# Altium schematic sheet Sch1.SchDoc
size A4
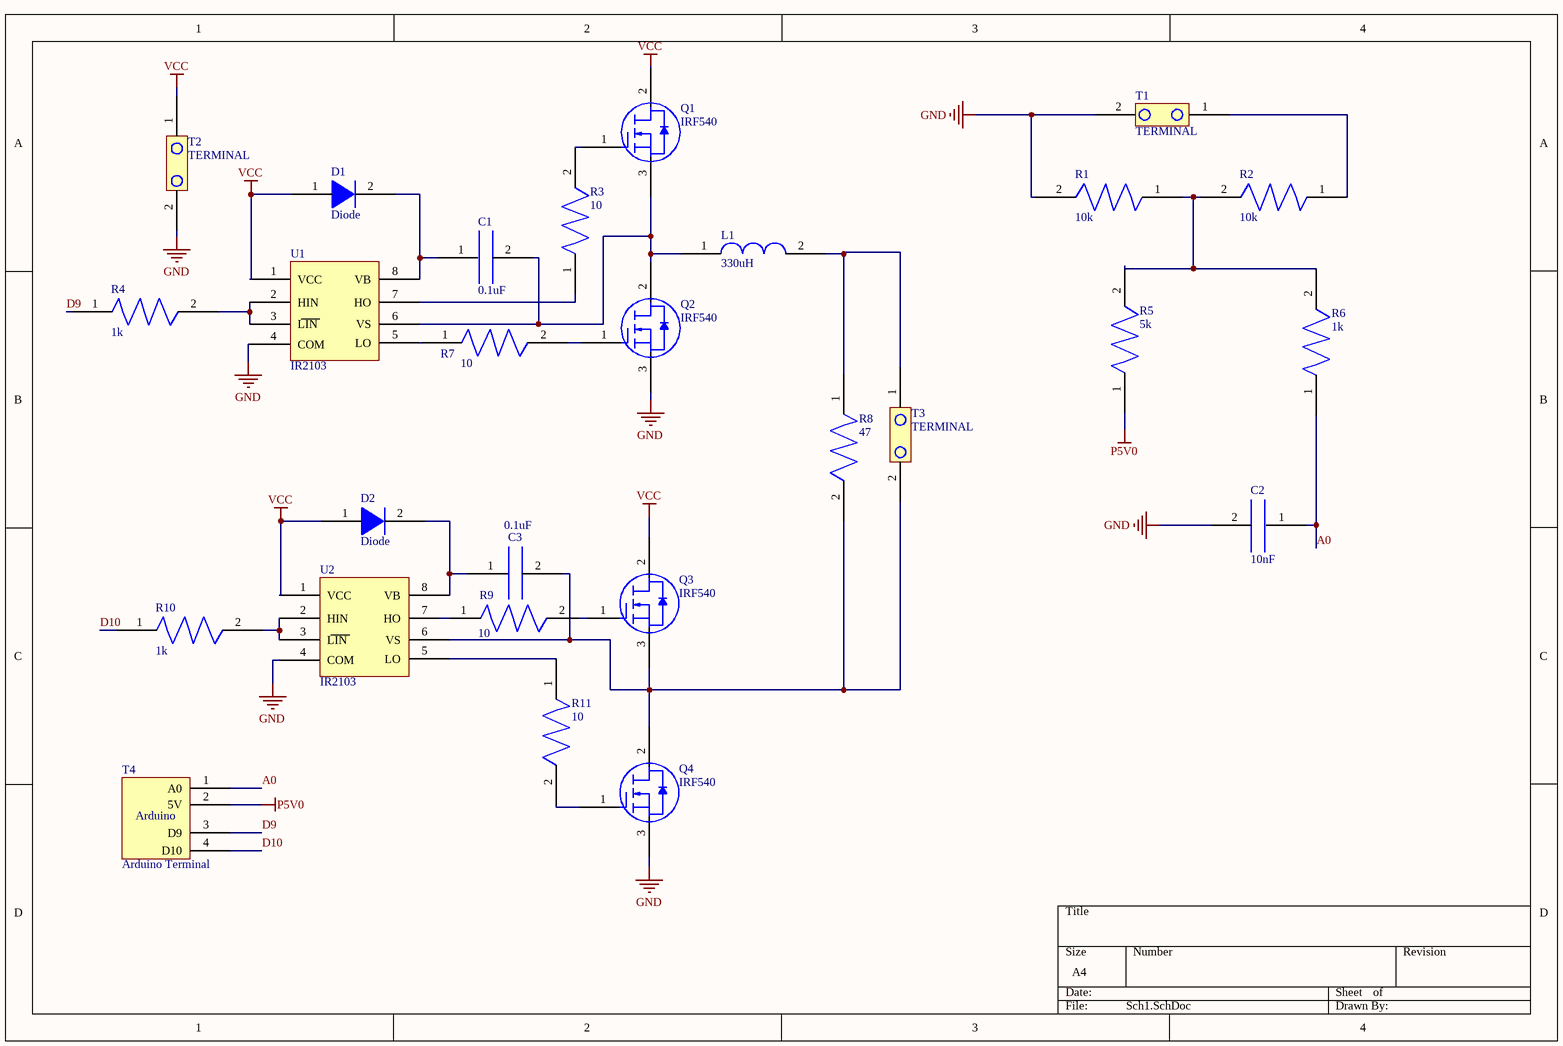
[diagram p0: Sch1.SchDoc]

## Parts
C1  0.1uF  [capacitor]
C2  10nF  [capacitor]
C3  0.1uF  [capacitor]
D1  Diode  [1N4148TA]
D2  Diode  [1N4148TA]
L1  330uH  [Inductor]
Q1  IRF540  [IRF540]
Q2  IRF540  [IRF540]
Q3  IRF540  [IRF540]
Q4  IRF540  [IRF540]
R1  10k  [Resistor]
R2  10k  [Resistor]
R3  10  [Resistor]
R4  1k  [Resistor]
R5  5k  [Resistor]
R6  1k  [Resistor]
R7  10  [Resistor]
R8  47  [Resistor]
R9  10  [Resistor]
R10  1k  [Resistor]
R11  10  [Resistor]
T1  TERMINAL  [SOURCE TERMINAL]
T2  TERMINAL  [SOURCE TERMINAL]
T3  TERMINAL  [SOURCE TERMINAL]
T4  Arduino Terminal  [ARDUINO TERMINAL]
U1  IR2103  [IR2103]
U2  IR2103  [IR2103]

## Nets
GND: C2.2 Q2.3(S) Q4.3(S) R1.2 T1.2 T2.2 U1.4(COM) U2.4(COM)
P5V0: R5.1 T4.2(5V)
VCC: D1.1 D2.1 Q1.2(D) Q3.2(D) T2.1 U1.1(VCC) U2.1(VCC)
A0: C2.1 R6.1 T4.1(A0)
D9: R4.1 T4.3(D9)
D10: R10.1 T4.4(D10)
NetC1_1: C1.1 D1.2 U1.8(VB)
NetC1_2: C1.2 L1.1 Q1.3(S) Q2.2(D) U1.6(VS)
NetC3_1: C3.1 D2.2 U2.8(VB)
NetC3_2: C3.2 Q3.3(S) Q4.2(D) R8.2 T3.2 U2.6(VS)
NetL1_2: L1.2 R8.1 T3.1
NetQ1_1: Q1.1(G) R3.2
NetQ2_1: Q2.1(G) R7.2
NetQ3_1: Q3.1(G) R9.2
NetQ4_1: Q4.1(G) R11.2
NetR1_1: R1.1 R2.2 R5.2 R6.2
NetR2_1: R2.1 T1.1
NetR3_1: R3.1 U1.7(HO)
NetR4_2: R4.2 U1.2(HIN) U1.3(LIN)
NetR7_1: R7.1 U1.5(LO)
NetR9_1: R9.1 U2.7(HO)
NetR10_2: R10.2 U2.2(HIN) U2.3(LIN)
NetR11_1: R11.1 U2.5(LO)

## Notes on the sheet
- (in symbol Arduino Terminal) Arduino

## Library data of the parts
C1-C3 = Capacitor
L1 = Inductor
R1-R11 = Resistor 0805